# EAGLE design PadSwitcher64 dip (EAGLE 7.3.0)
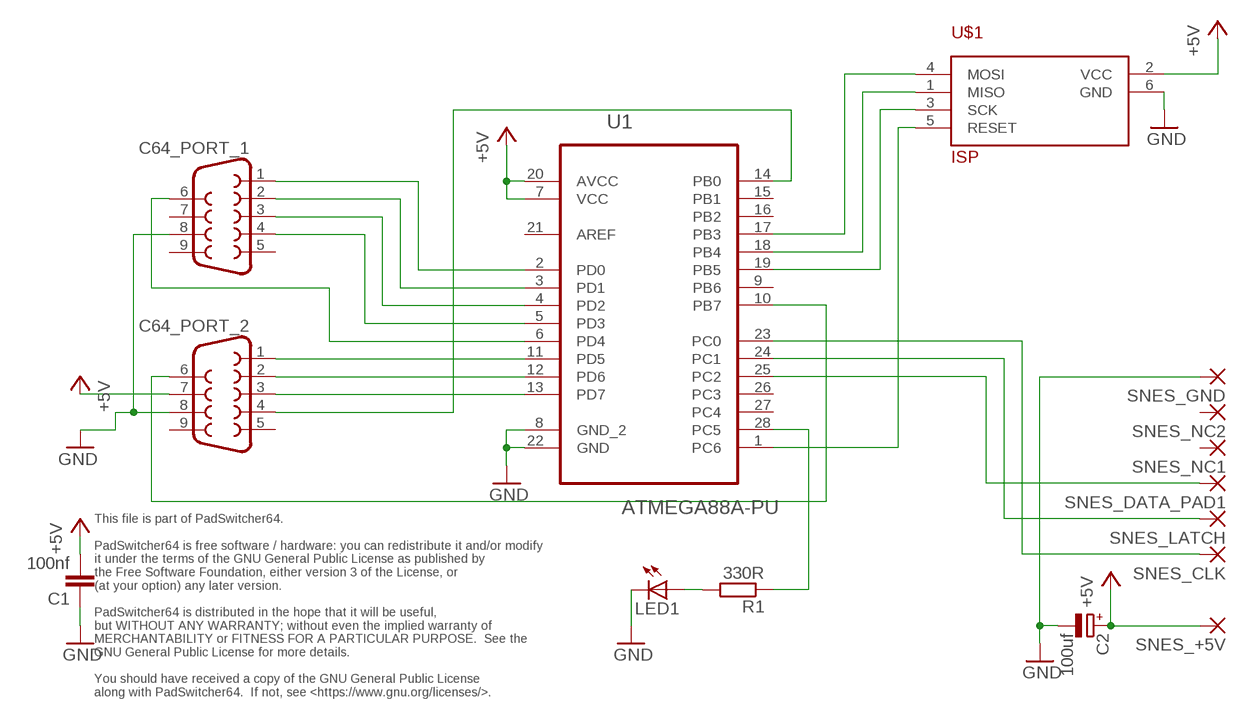
[diagram p0: schematic, sheet 1]

## Parts
C1  100nf  C-EU050-024X044  [C050-024X044]
C2  100uf  CPOL-EUE2.5-5  [E2,5-5]
C64_PORT_1  F09  [F09VB_NO_SHELL]
C64_PORT_2  F09  [F09VB_NO_SHELL]
LED1  LEDSQR2X5  [LED2X5]
R1  330R  R-EU_0207/10  [0207/10]
SNES_+5V  3,17/1,1  [3,17/1,1]
SNES_CLK  3,17/1,1  [3,17/1,1]
SNES_DATA_PAD1  3,17/1,1  [3,17/1,1]
SNES_GND  3,17/1,1  [3,17/1,1]
SNES_LATCH  3,17/1,1  [3,17/1,1]
SNES_NC1  3,17/1,1  [3,17/1,1]
SNES_NC2  3,17/1,1  [3,17/1,1]
U1  ATMEGA88A-PU  [DIL28-3]
U$1  ISP  AVR_ISP6  [MA03-2]

## Nets
+5V: C1.2 C2.+ C64_PORT_2.7 SNES_+5V.1(P) U1.7(VCC) U1.20(AVCC) U$1.2(VCC)
GND: C1.1 C2.- C64_PORT_1.8 C64_PORT_2.8 LED1.K(C) SNES_GND.1(P) U1.8(GND_2) U1.22(GND) U$1.6(GND)
N$1: U1.1(PC6) U$1.5(RESET)
N$2: U1.19(PB5) U$1.3(SCK)
N$3: U1.18(PB4) U$1.1(MISO)
N$4: U1.17(PB3) U$1.4(MOSI)
N$5: C64_PORT_1.1 U1.2(PD0)
N$6: C64_PORT_1.2 U1.3(PD1)
N$7: C64_PORT_1.3 U1.4(PD2)
N$8: C64_PORT_1.4 U1.5(PD3)
N$9: C64_PORT_1.6 U1.6(PD4)
N$10: C64_PORT_2.6 U1.10(PB7)
N$11: C64_PORT_2.1 U1.11(PD5)
N$12: C64_PORT_2.2 U1.12(PD6)
N$13: C64_PORT_2.3 U1.13(PD7)
N$14: C64_PORT_2.4 U1.14(PB0)
N$15: SNES_CLK.1(P) U1.23(PC0)
N$16: SNES_LATCH.1(P) U1.24(PC1)
N$17: SNES_DATA_PAD1.1(P) U1.25(PC2)
N$18: R1.1 U1.28(PC5)
N$19: LED1.A R1.2
Unconnected: C64_PORT_1.5 C64_PORT_1.7 C64_PORT_1.9 C64_PORT_2.5 C64_PORT_2.9 SNES_NC1.1(P) SNES_NC2.1(P) U1.9(PB6) U1.15(PB1) U1.16(PB2) U1.21(AREF) U1.26(PC3) U1.27(PC4)

## Notes on the sheet
- This file is part of PadSwitcher64.
  
      PadSwitcher64 is free software / hardware: you can redistribute it and/or modify
      it under the terms of the GNU General Public License as published by
      the Free Software Foundation, either version 3 of the License, or
      (at your option) any later version.
  
      PadSwitcher64 is distributed in the hope that it will be useful,
      but WITHOUT ANY WARRANTY; without even the implied warranty of
      MERCHANTABILITY or FITNESS FOR A PARTICULAR PURPOSE.  See the
      GNU General Public License for more details.
  
      You should have received a copy of the GNU General Public License
      along with PadSwitcher64.  If not, see <https://www.gnu.org/licenses/>.

## Library data of the parts
C1 = resistor:C-EU: CAPACITOR, European symbol
C2 = resistor:CPOL-EU: POLARIZED CAPACITOR, European symbol
C64_PORT_1 C64_PORT_2 = Mine:F09: SUB-D
LED1 = led:LED: LED OSRAM: - CHIPLED LG R971, LG N971, LY N971, LG Q971, LY Q971, LO R971, LY R971 LH N974, LH R974 LS Q976, LO Q976, LY Q976 LO Q996 - Hyper CHIPLED LW Q18S LB Q993, LB Q99A, LB R99A - SideLED LS A670, LO A670, LY A670, LG A670, LP A670 LB A673, LV A673, LT A673, LW A673 LH A674 LY A675 LS A676, LA A676, LO A676, LY A676, LW A676 LS A679, LY A679, LG A679 - Hyper Micro SIDELED® LS Y876, LA Y876, LO Y876, LY Y876 LT Y87S - SmartLED LW L88C, LW L88S LB L89C, LB L89S, LG L890 LS L89K, LO L89K, LY L89K LS L896, LA L896, LO L896, LY L896 - TOPLED LS T670, LO T670, LY T670, LG T670, LP T670 LSG T670, LSP T670, LSY T670, LOP T670, LYG T670 LG T671, LOG T671, LSG T671 LB T673, LV T673, LT T673, LW T673 LH T674 LS T676, LA T676, LO T676, LY T676, LB T676, LH T676, LSB T676, LW T676 LB T67C, LV T67C, LT T67C, LS T67K, LO T67K, LY T67K, LW E67C LS E67B, LA E67B, LO E67B, LY E67B, LB E67C, LV E67C, LT E67C LW T67C LS T679, LY T679, LG T679 LS T770, LO T770, LY T770, LG T770, LP T770 LB T773, LV T773, LT T773, LW T773 LH T774 LS E675, LA E675, LY E675, LS T675 LS T776, LA T776, LO T776, LY T776, LB T776 LHGB T686 LT T68C, LB T68C - Hyper Mini TOPLED® LB M676 - Mini TOPLED Santana® LG M470 LS M47K, LO M47K, LY M47K Source: http://www.osram.convergy.de LUXEON: - LUMILED® LXK2-PW12-R00, LXK2-PW12-S00, LXK2-PW14-U00, LXK2-PW14-V00 LXK2-PM12-R00, LXK2-PM12-S00, LXK2-PM14-U00 LXK2-PE12-Q00, LXK2-PE12-R00, LXK2-PE12-S00, LXK2-PE14-T00, LXK2-PE14-U00 LXK2-PB12-K00, LXK2-PB12-L00, LXK2-PB12-M00, LXK2-PB14-N00, LXK2-PB14-P00, LXK2-PB14-Q00 LXK2-PR12-L00, LXK2-PR12-M00, LXK2-PR14-Q00, LXK2-PR14-R00 LXK2-PD12-Q00, LXK2-PD12-R00, LXK2-PD12-S00 LXK2-PH12-R00, LXK2-PH12-S00 LXK2-PL12-P00, LXK2-PL12-Q00, LXK2-PL12-R00 Source: www.luxeon.com KINGBRIGHT: KA-3528ASYC Source: www.kingbright.com
R1 = resistor:R-EU_: RESISTOR, European symbol
SNES_+5V SNES_CLK SNES_DATA_PAD1 SNES_GND SNES_LATCH SNES_NC1 SNES_NC2 = wirepad:3,17/1,1: THROUGH-HOLE PAD
U1 = Mine:ATMEGA88A-PU: MCU
U$1 = Mine:AVR_ISP6

## Board
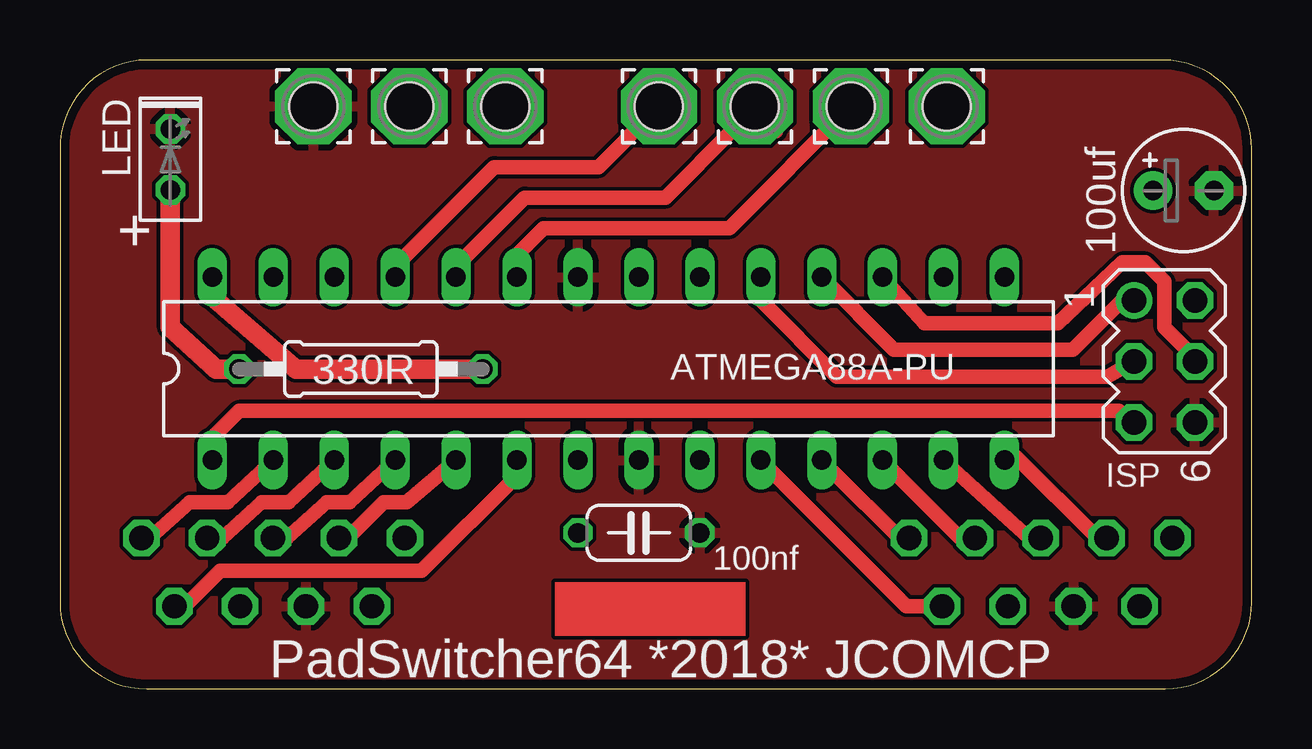
[diagram p1: board, top side]
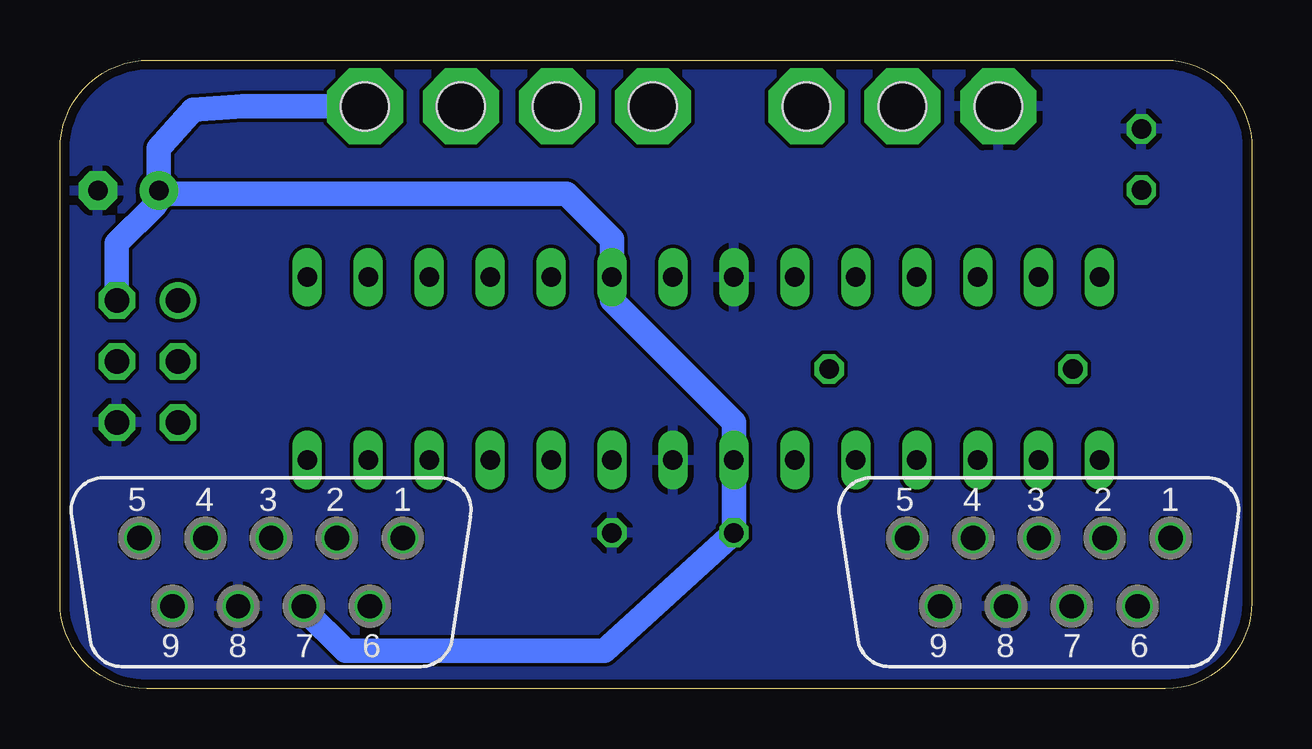
[diagram p2: board, bottom side, seen from below]

Size 49.68 x 26.2 mm. Coordinates in mm from the lower left corner, seen from the top.
Outline: 0,22.49 0,3.61 arc90 3.61,0 46.07,0 arc90 49.68,3.61 49.68,22.48 arc90 45.96,26.2 3.61,26.2 arc90 0,22.49
Copper layers (1*16): Top 0.0356mm / dielectric 1.5011mm / Bottom 0.0356mm
Design rules "oshpark-2layer *": minimum track width 6mil, minimum drill 13mil, track to track 6mil, track to pad 6mil, pad to pad 6mil, via to via 6mil, smd to smd 6mil, copper to edge 15mil, drill to drill 6mil, minimum pad ring 7mil, minimum via ring 7mil, stop-mask expansion 4mil, vias tented up to drill 20mil, thermal gap 10mil
Holes 2 mm at 36.97,24.27 32.97,24.27 28.96,24.27 24.96,24.27 18.56,24.27 14.56,24.27 10.56,24.27

### Footprints (pad centres in the part's own frame; a part is rotated, then mirrored left to right if it is on the bottom)
C050-024X044 = drill 0.813 octagon: 1 -2.54,0; 2 2.54,0
E2,5-5 = drill 0.813 pad 1.6: + -1.27,0 | drill 0.813 pad 1.6 octagon: - 1.27,0
F09VB_NO_SHELL = drill 1.016 octagon: 1 -5.486,-1.422; 2 -2.743,-1.422; 3 0,-1.422; 4 2.743,-1.422; 5 5.486,-1.422; 6 -4.115,1.422; 7 -1.372,1.422; 8 1.372,1.422; 9 4.115,1.422
LED2X5 = drill 0.813 octagon: A -1.27,0; K 1.27,0
0207/10 = drill 0.813 octagon: 1 -5.08,0; 2 5.08,0
3,17/1,1 = drill 1.118 pad 3.175 octagon: 1 0,0
DIL28-3 = drill 0.813 long: 1 -16.51,-3.81; 2 -13.97,-3.81; 3 -11.43,-3.81; 4 -8.89,-3.81; 5 -6.35,-3.81; 6 -3.81,-3.81; 7 -1.27,-3.81; 8 1.27,-3.81; 9 3.81,-3.81; 10 6.35,-3.81; 11 8.89,-3.81; 12 11.43,-3.81; 13 13.97,-3.81; 14 16.51,-3.81; 15 16.51,3.81; 16 13.97,3.81; 17 11.43,3.81; 18 8.89,3.81; 19 6.35,3.81; 20 3.81,3.81; 21 1.27,3.81; 22 -1.27,3.81; 23 -3.81,3.81; 24 -6.35,3.81; 25 -8.89,3.81; 26 -11.43,3.81; 27 -13.97,3.81; 28 -16.51,3.81
MA03-2 = drill 1.016: 1 -2.54,-1.27 | drill 1.016 octagon: 2 -2.54,1.27; 3 0,-1.27; 4 0,1.27; 5 2.54,-1.27; 6 2.54,1.27

### Placement (x,y rotation side)
C1  24.13,6.5 180 top
C2  46.83,20.77 0 top
C64_PORT_1  8.88,4.87 180 bottom
C64_PORT_2  40.88,4.87 180 bottom
LED1  4.6,22.06 90 top
R1  12.54,13.33 180 top
SNES_+5V  36.97,24.27 180 top
SNES_CLK  32.97,24.27 180 top
SNES_DATA_PAD1  24.96,24.27 180 top
SNES_GND  10.56,24.27 180 top
SNES_LATCH  28.96,24.27 180 top
SNES_NC1  18.56,24.27 180 top
SNES_NC2  14.56,24.27 180 top
U1  22.86,13.35 0 top
U$1  46.04,13.65 270 top

### Tracks (layer width: path | path; a pad name or v marks a point on that pad's centre or on a via)
+5V
  Bottom 1.016: C64_PORT_2.7 39.51,3.31 37.78,1.58 26.99,1.58 C1.2 U1.7 21.59,11.11 26.67,16.19 U1.20 | U1.20 26.67,16.98 | U1.20 26.67,18.73 28.57,20.63 45.4,20.63 45.72,20.15 | 45.72,20.15 C2.+ 45.56,22.54 44.13,24.12 42.07,24.28 SNES_+5V.1 | U$1.2 47.31,18.57 45.72,20.15
GND
  pour Top: 0,26.39 49.85,26.39 49.85,-0.32 0,-0.32
  pour Bottom: 0,26.39 49.85,26.39 49.85,-0.32 0,-0.32
N$1
  Top 0.61: U1.1 6.35,10.47 7.46,11.58 44.13,11.58 U$1.5
N$2
  Top 0.61: U$1.3 43.66,13.01 32.39,13.01 29.21,16.19 U1.19
N$3
  Top 0.61: U$1.1 44.29,16.19 42.23,14.12 34.77,14.12 U1.18
N$4
  Top 0.61: U$1.4 47.31,13.8 46.04,15.07 46.04,16.98 45.24,17.77 44.29,17.77 41.59,15.23 36.04,15.23 U1.17
N$5
  Top 0.61: C64_PORT_1.1 3.75,6.29 5.4,7.77 6.99,7.77 U1.2
N$6
  Top 0.61: C64_PORT_1.2 6.77,6.29 8.41,7.77 9.52,7.77 U1.3
N$7
  Top 0.61: C64_PORT_1.3 9.47,6.29 11.11,7.77 12.06,7.77 U1.4
N$8
  Top 0.61: C64_PORT_1.4 12.01,6.29 13.49,7.77 14.45,7.77 U1.5
N$9
  Top 0.61: C64_PORT_1.6 5.2,3.44 6.67,4.91 15.08,4.91 19.05,8.88 U1.6
N$10
  Top 0.61: C64_PORT_2.6 35.29,3.44 29.53,9.2 29.21,9.2 U1.10
N$11
  Top 0.61: C64_PORT_2.1 34.98,6.29 32.23,9.04 31.91,9.04 31.75,9.2 U1.11
N$12
  Top 0.61: C64_PORT_2.2 37.52,6.29 U1.12
N$13
  Top 0.61: C64_PORT_2.3 40.38,6.29 U1.13
N$14
  Top 0.61: C64_PORT_2.4 43.23,6.29 39.85,9.68 39.53,9.68 U1.14
N$15
  Top 0.61: U1.23 19.05,18.09 20.16,19.2 27.91,19.2 SNES_CLK.1
N$16
  Top 0.61: U1.24 16.51,17.61 19.37,20.47 25.24,20.47 28.1,23.33 29.85,23.23 SNES_LATCH.1
N$17
  Top 0.61: U1.25 13.97,17.61 18.1,21.74 22.45,21.74 SNES_DATA_PAD1.1
N$18
  Top 0.813: R1.1 9.84,13.33 6.35,16.34 U1.28
N$19
  Top 0.813: R1.2 6.51,13.33 4.6,15.07 LED1.A
(copper drawn outside any net)
  shapes: Top area x1

### Text on the board
tPlace: +
tNames: LED | PadSwitcher64 *2018* JCOMCP
tStop: REV. 5p
comment: This file is part of PadSwitcher64. / / PadSwitcher64 is free software / hardware: you can redistribute it and/or / modify it under the terms of the GNU General Public License as published / by the Free Software Foundation, either version 3 of the License, or (at / your option) any later version. / / PadSwitcher64 is distributed in the hope that it will be useful, but / WITHOUT ANY WARRANTY; without even the implied warranty of MERCHANTABILITY / or FITNESS FOR A PARTICULAR PURPOSE. See the GNU General Public License / for more details. / / You should have received a copy of the GNU General Public License along / with PadSwitcher64. If not, see <https://www.gnu.org/licenses/>.